# EAGLE design attinier84-2digit-shield-mk-2.0 (EAGLE 6.5.0)
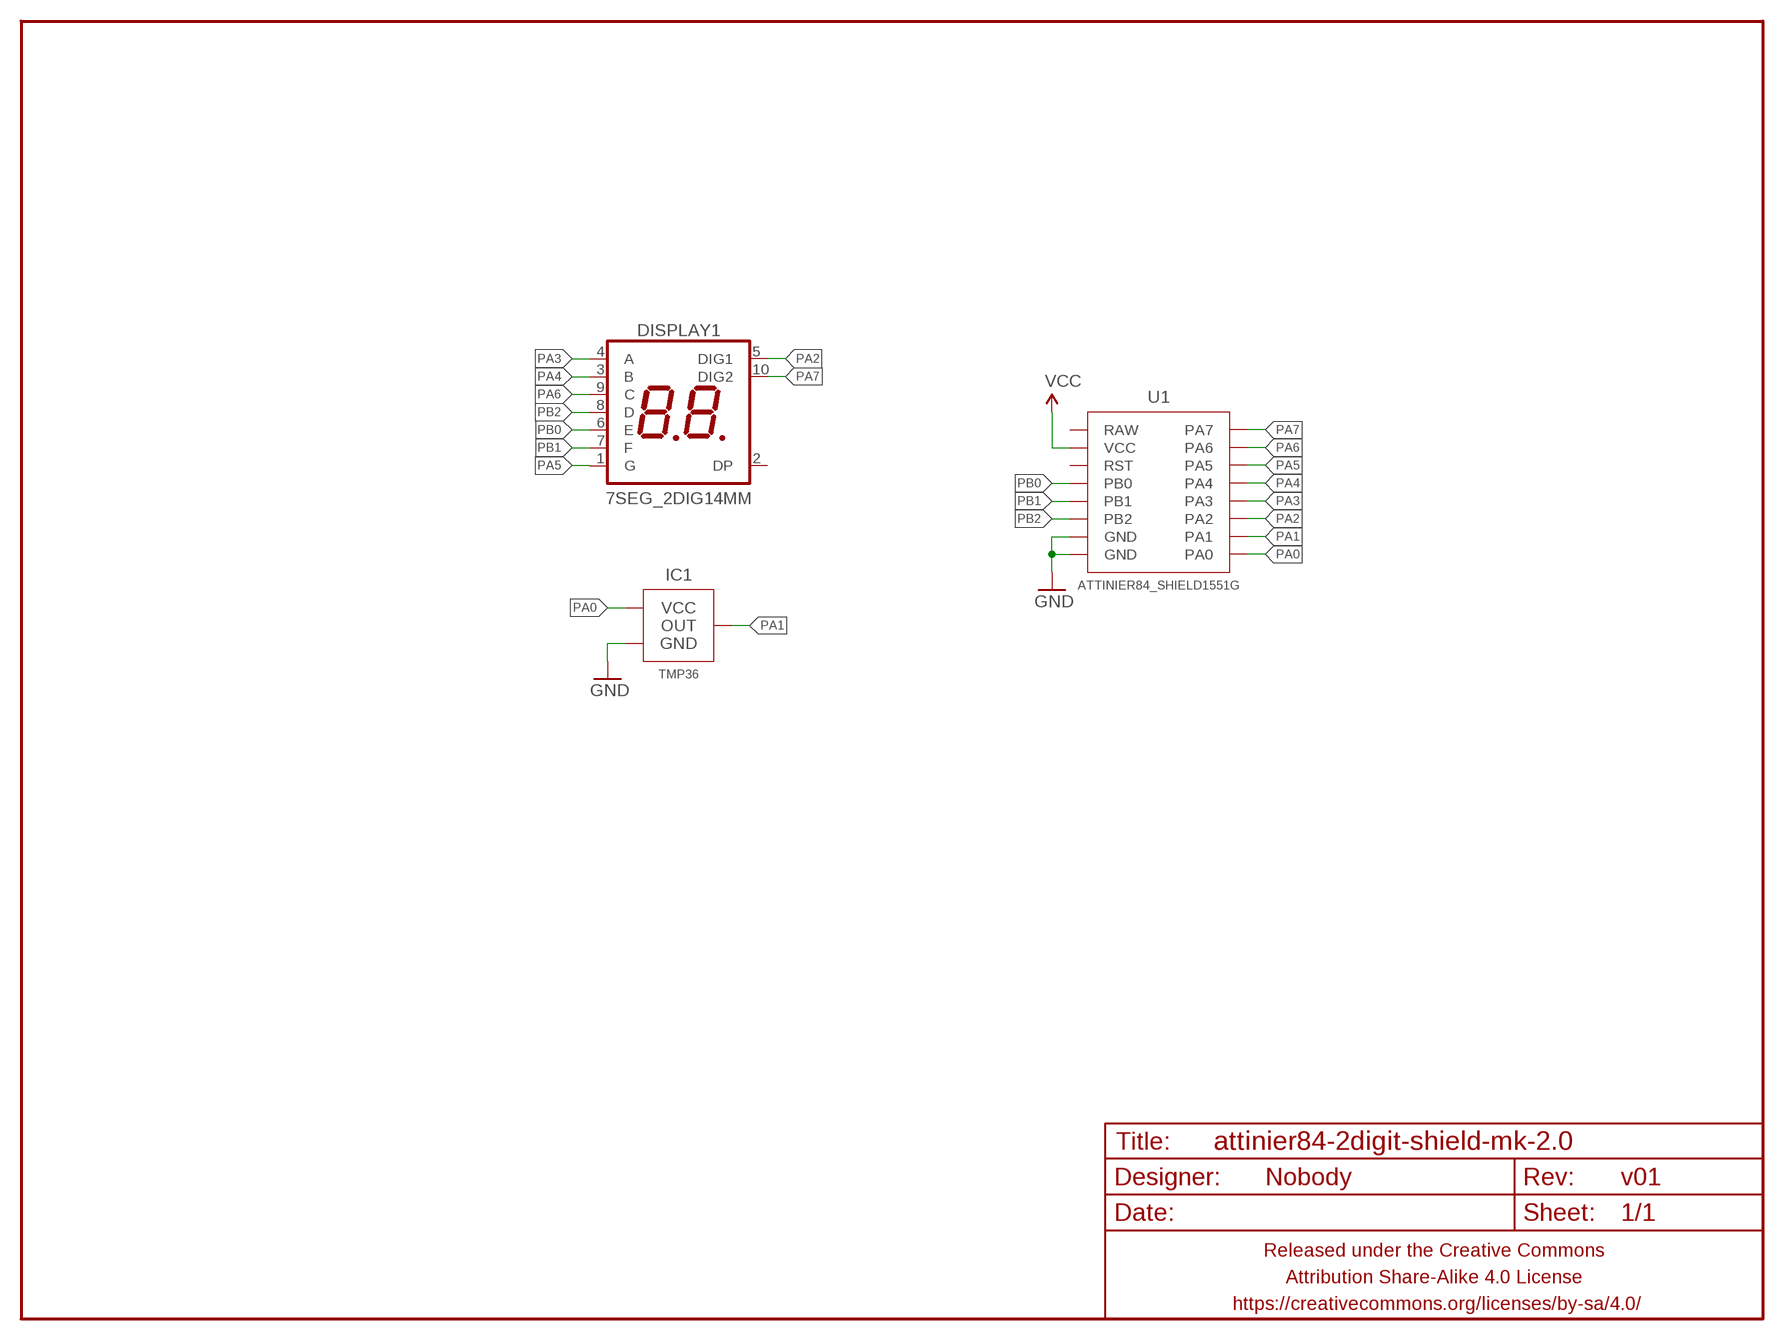
[diagram p0: schematic, sheet 1]

## Parts
DISPLAY1  7SEG_2DIG14MM  [7SEG_2DIG_14MM]
FRAME1  FRAME-LETTERNO_PACKAGE  [DUMMY]
IC1  TMP36  TMP36TO-92  [TO-92-AMMO]
U1  ATTINIER84_SHIELD1551G  [ATTINIER84_SHIELD2]

## Nets
GND: IC1.3(GND) U1.GND@1(GND) U1.GND@2(GND)
PA0: IC1.1(VCC) U1.PA0
PA1: IC1.2(OUT) U1.PA1
PA2: DISPLAY1.5(DIG1) U1.PA2
PA3: DISPLAY1.4(A) U1.PA3
PA4: DISPLAY1.3(B) U1.PA4
PA5: DISPLAY1.1(G) U1.PA5
PA6: DISPLAY1.9(C) U1.PA6
PA7: DISPLAY1.10(DIG2) U1.PA7
PB0: DISPLAY1.6(E) U1.PB0
PB1: DISPLAY1.7(F) U1.PB1
PB2: DISPLAY1.8(D) U1.PB2
VCC: U1.VCC
Unconnected: DISPLAY1.2(DP) U1.RAW U1.RST

## Library data of the parts
DISPLAY1 = A_butts:7SEG_2DIG
FRAME1 = A_butts:FRAME-LETTER: Schematic Frame Standard 8.5x11 US Letter frame; DESIGNER: Nobody; VERSION: v01
IC1 = A_butts:TMP36
U1 = A_butts:ATTINIER84_SHIELD

## Board
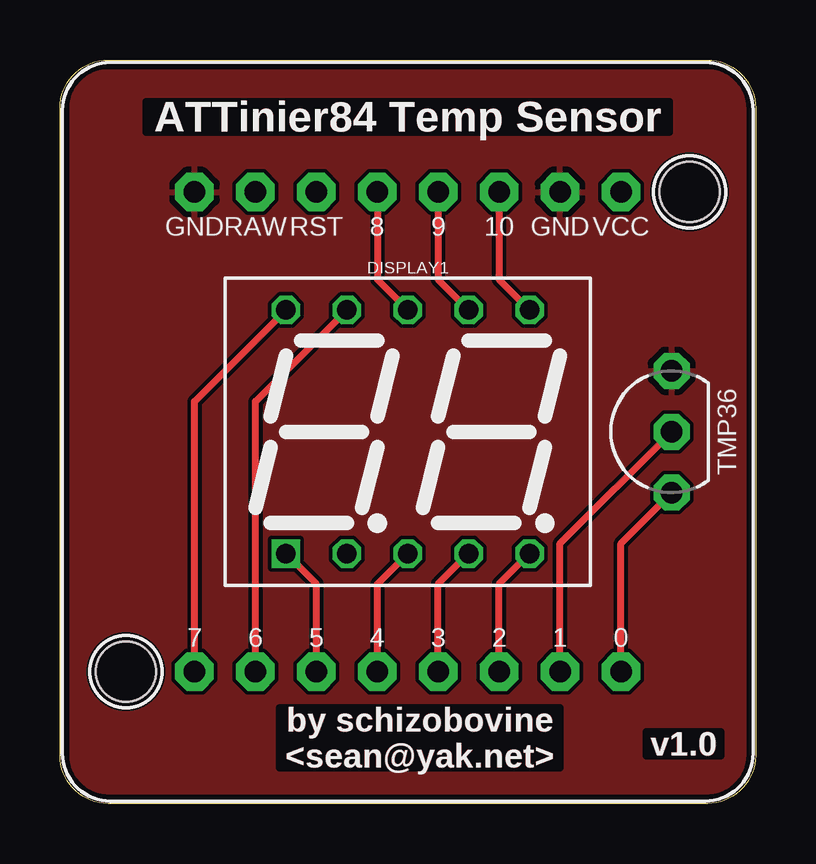
[diagram p1: board, top side]
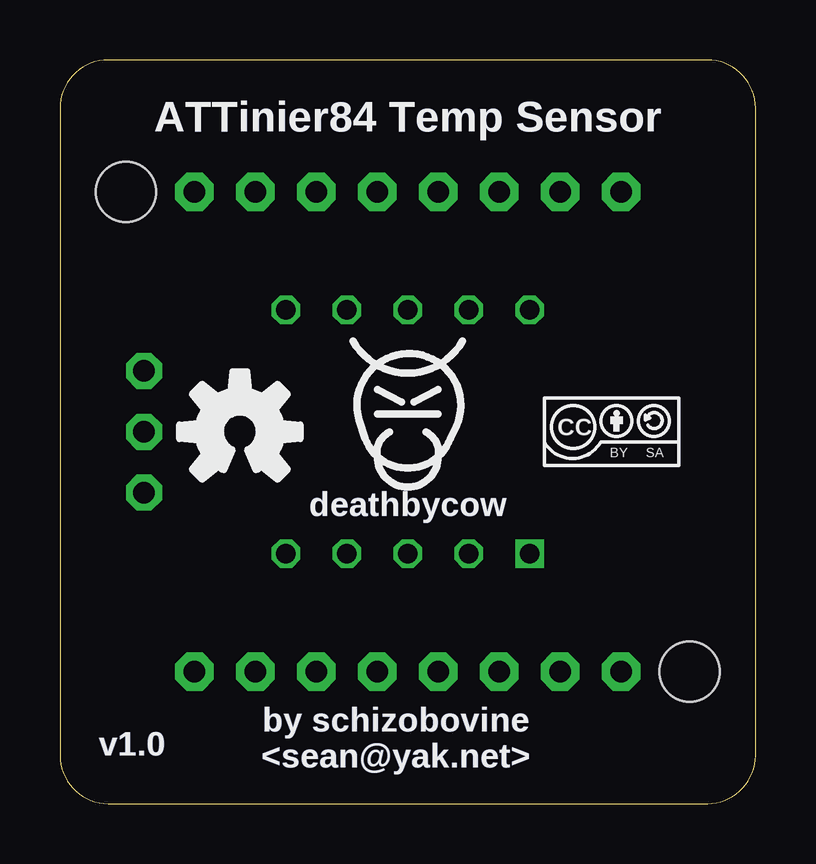
[diagram p2: board, bottom side, seen from below]

Size 29 x 31 mm. Coordinates in mm from the lower left corner, seen from the top.
Copper layers (1*16): Top 0.0356mm / dielectric 1.5011mm / Bottom 0.0356mm
Design rules "LaenPCBOrder_2": minimum track width 6mil, minimum drill 13mil, track to track 6mil, track to pad 6mil, pad to pad 6mil, via to via 6mil, smd to smd 6mil, copper to edge 15mil, drill to drill 6mil, minimum pad ring 7mil, minimum via ring 7mil, stop-mask expansion 3mil, vias tented up to drill 20mil, thermal gap 10mil

### Footprints (pad centres in the part's own frame; a part is rotated, then mirrored left to right if it is on the bottom)
7SEG_2DIG_14MM = drill 0.8 square: 1 -5.08,-5.08 | drill 0.8 octagon: 2 -2.54,-5.08; 3 0,-5.08; 4 2.54,-5.08; 5 5.08,-5.08; 6 5.08,5.08; 7 2.54,5.08; 8 0,5.08; 9 -2.54,5.08; 10 -5.08,5.08
TO-92-AMMO = drill 0.9 pad 1.5 octagon: 1 -2.54,0; 2 0,0; 3 2.54,0
ATTINIER84_SHIELD2 = drill 0.9 pad 1.6 octagon: GND@1 10,-6.35; GND@2 10,8.89; PA0 -10,-8.89; PA1 -10,-6.35; PA2 -10,-3.81; PA3 -10,-1.27; PA4 -10,1.27; PA5 -10,3.81; PA6 -10,6.35; PA7 -10,8.89; PB0 10,-3.81; PB1 10,-1.27; PB2 10,1.27; RAW 10,6.35; RST 10,3.81; VCC 10,-8.89 | hole 2.5: -10,11.75; 10,-11.75

### Placement (x,y rotation side)
DISPLAY1  14.5,15.5 0 top
FRAME1  29,0 90 top
IC1  25.5,15.5 90 top
U1  14.5,15.5 90 top
U$1  [CC-BY-SA-4.0-NO-URL]  6,15.5 0 bottom
U$2  [COW_SMALL_METAL]  14.5,16.75 0 bottom
U$3  [OSHWLOGO_BOT_0.2_A]  21.5,15.5 0 top

### Tracks (layer width: path | path; a pad name or v marks a point on that pad's centre or on a via)
GND
  pour Top: 29.1,-0.1 -0.1,-0.1 -0.1,31.1 29.1,31.1
PA0
  Top 0.3: U1.PA0 23.39,10.85 IC1.1
PA1
  Top 0.3: U1.PA1 20.85,10.85 IC1.2
PA2
  Top 0.3: U1.PA2 18.31,9.15 DISPLAY1.5
PA3
  Top 0.3: U1.PA3 15.77,9.15 DISPLAY1.4
PA4
  Top 0.3: U1.PA4 13.23,9.15 DISPLAY1.3
PA5
  Top 0.3: U1.PA5 10.69,9.15 DISPLAY1.1
PA6
  Top 0.3: U1.PA6 8.15,16.77 DISPLAY1.9
PA7
  Top 0.3: U1.PA7 5.61,16.77 DISPLAY1.10
PB0
  Top 0.3: U1.PB0 18.31,21.85 DISPLAY1.6
PB1
  Top 0.3: U1.PB1 15.77,21.85 DISPLAY1.7
PB2
  Top 0.3: U1.PB2 13.23,21.85 DISPLAY1.8

### Text on the board
Top: ATTinier84 Temp Sensor | by schizobovine / <sean@yak.net>
Bottom: ATTinier84 Temp Sensor | by schizobovine / <sean@yak.net>
tPlace: ATTinier84 Temp Sensor | by schizobovine / <sean@yak.net>
bPlace: ATTinier84 Temp Sensor | by schizobovine / <sean@yak.net>